# EAGLE design pro-micro-ora (EAGLE 7.1.0)
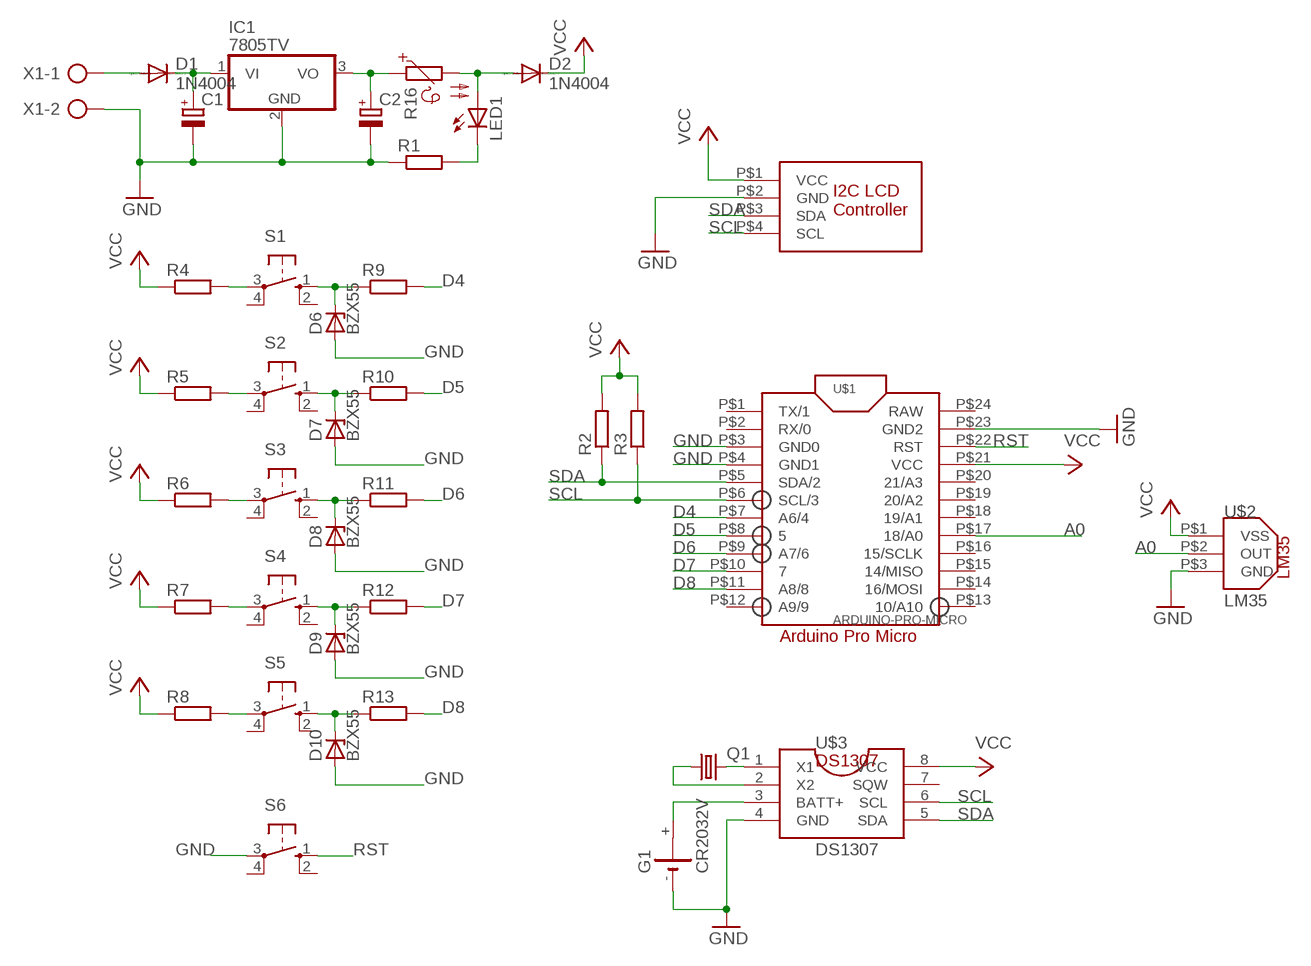
[diagram p0: schematic, sheet 1]

## Parts
C1  CPOL-EUE2.5-5  [E2,5-5]
C2  CPOL-EUE2.5-5  [E2,5-5]
D1  1N4004  [DO41-10]
D2  1N4004  [DO41-10]
D6  BZX55  [DO35Z10]
D7  BZX55  [DO35Z10]
D8  BZX55  [DO35Z10]
D9  BZX55  [DO35Z10]
D10  BZX55  [DO35Z10]
G1  CR2032V  [CR2032V]
IC1  7805TV  [TO220V]
LED1  LED5MM  [LED5MM]
Q1  CRYSTALTC26H  [TC26H]
R1  R-EU_0204/7  [0204/7]
R2  R-EU_0204/7  [0204/7]
R3  R-EU_0204/7  [0204/7]
R4  R-EU_0204/7  [0204/7]
R5  R-EU_0204/7  [0204/7]
R6  R-EU_0204/7  [0204/7]
R7  R-EU_0204/7  [0204/7]
R8  R-EU_0204/7  [0204/7]
R9  R-EU_0204/7  [0204/7]
R10  R-EU_0204/7  [0204/7]
R11  R-EU_0204/7  [0204/7]
R12  R-EU_0204/7  [0204/7]
R13  R-EU_0204/7  [0204/7]
R16  PTC660  [P660]
S1  10-XX  [B3F-10XX]
S2  10-XX  [B3F-10XX]
S3  10-XX  [B3F-10XX]
S4  10-XX  [B3F-10XX]
S5  10-XX  [B3F-10XX]
S6  10-XX  [B3F-10XX]
U$1  ARDUINO-PRO-MICRO  [ARDUINO-PRO-MICRO]
U$2  LM35  [LM35]
U$3  DS1307  [DS1307]
U$4  I2C_LCD  [I2C_LCD]
X1  AK500/2  [AK500/2]

## Nets
A0: U$1.P$17(18/A0) U$2.P$2(OUT)
D4: R9.2 U$1.P$7(A6/4)
D5: R10.2 U$1.P$8
D6: R11.2 U$1.P$9(A7/6)
D7: R12.2 U$1.P$10
D8: R13.2 U$1.P$11(A8/8)
GND: C1.- C2.- D6.A D7.A D8.A D9.A D10.A G1.- IC1.2(GND) R1.1 S6.3(P) U$1.P$3(GND0) U$1.P$4(GND1) U$1.P$23(GND2) U$2.P$3(GND) U$3.4(GND) U$4.P$2(GND) X1.2
N$1: D1.A X1.1
N$2: C1.+ D1.C IC1.1(VI)
N$3: D2.A LED1.A R16.2
N$4: LED1.K(C) R1.2
N$5: C2.+ IC1.3(VO) R16.1
N$6: R4.2 S1.3(P)
N$7: R5.2 S2.3(P)
N$8: R6.2 S3.3(P)
N$9: R7.2 S4.3(P)
N$10: R8.2 S5.3(P)
N$11: D6.C R9.1 S1.1(S)
N$12: D7.C R10.1 S2.1(S)
N$13: D8.C R11.1 S3.1(S)
N$14: D9.C R12.1 S4.1(S)
N$15: D10.C R13.1 S5.1(S)
N$16: Q1.1 U$3.2(X2)
N$17: Q1.2 U$3.1(X1)
N$18: G1.+ U$3.3(BATT+)
RST: S6.1(S) U$1.P$22(RST)
SCL: R3.1 U$1.P$6(SCL/3) U$3.6(SCL) U$4.P$4(SCL)
SDA: R2.1 U$1.P$5(SDA/2) U$3.5(SDA) U$4.P$3(SDA)
VCC: D2.C R2.2 R3.2 R4.1 R5.1 R6.1 R7.1 R8.1 U$1.P$21(VCC) U$2.P$1(VSS) U$3.8(VCC) U$4.P$1(VCC)
Unconnected: G1.+@1(+) S1.2(S1) S1.4(P1) S2.2(S1) S2.4(P1) S3.2(S1) S3.4(P1) S4.2(S1) S4.4(P1) S5.2(S1) S5.4(P1) S6.2(S1) S6.4(P1) U$1.P$1(TX/1) U$1.P$2(RX/0) U$1.P$12(A9/9) U$1.P$13(10/A10) U$1.P$14(16/MOSI) U$1.P$15(14/MISO) U$1.P$16(15/SCLK) U$1.P$18(19/A1) U$1.P$19(20/A2) U$1.P$20(21/A3) U$3.7(SQW)

## Power pins joined to a net without a drawn wire
RAW: U$1.P$24(RAW)

## Library data of the parts
C1 C2 = rcl:CPOL-EU: POLARIZED CAPACITOR, European symbol
D1 D2 = diode:1N4004: DIODE general purpose rectifier, 1 A
D6-D10 = diode:BZX55: Z DIODE
G1 = battery:CR2032V: LI BATTERY Varta
IC1 = linear:78*: Positive VOLTAGE REGULATOR Source: http://cache.national.com/ds/LM/LM78L05.pdf http://www.fairchildsemi.com/ds/LM/LM7805.pdf
LED1 = led:LED: LED OSRAM: - CHIPLED LG R971, LG N971, LY N971, LG Q971, LY Q971, LO R971, LY R971 LH N974, LH R974 LS Q976, LO Q976, LY Q976 LO Q996 - Hyper CHIPLED LW Q18S LB Q993, LB Q99A, LB R99A - SideLED LS A670, LO A670, LY A670, LG A670, LP A670 LB A673, LV A673, LT A673, LW A673 LH A674 LY A675 LS A676, LA A676, LO A676, LY A676, LW A676 LS A679, LY A679, LG A679 - Hyper Micro SIDELED® LS Y876, LA Y876, LO Y876, LY Y876 LT Y87S - SmartLED LW L88C, LW L88S LB L89C, LB L89S, LG L890 LS L89K, LO L89K, LY L89K LS L896, LA L896, LO L896, LY L896 - TOPLED LS T670, LO T670, LY T670, LG T670, LP T670 LSG T670, LSP T670, LSY T670, LOP T670, LYG T670 LG T671, LOG T671, LSG T671 LB T673, LV T673, LT T673, LW T673 LH T674 LS T676, LA T676, LO T676, LY T676, LB T676, LH T676, LSB T676, LW T676 LB T67C, LV T67C, LT T67C, LS T67K, LO T67K, LY T67K, LW E67C LS E67B, LA E67B, LO E67B, LY E67B, LB E67C, LV E67C, LT E67C LW T67C LS T679, LY T679, LG T679 LS T770, LO T770, LY T770, LG T770, LP T770 LB T773, LV T773, LT T773, LW T773 LH T774 LS E675, LA E675, LY E675, LS T675 LS T776, LA T776, LO T776, LY T776, LB T776 LHGB T686 LT T68C, LB T68C - Hyper Mini TOPLED® LB M676 - Mini TOPLED Santana® LG M470 LS M47K, LO M47K, LY M47K Source: http://www.osram.convergy.de LUXEON: - LUMILED® LXK2-PW12-R00, LXK2-PW12-S00, LXK2-PW14-U00, LXK2-PW14-V00 LXK2-PM12-R00, LXK2-PM12-S00, LXK2-PM14-U00 LXK2-PE12-Q00, LXK2-PE12-R00, LXK2-PE12-S00, LXK2-PE14-T00, LXK2-PE14-U00 LXK2-PB12-K00, LXK2-PB12-L00, LXK2-PB12-M00, LXK2-PB14-N00, LXK2-PB14-P00, LXK2-PB14-Q00 LXK2-PR12-L00, LXK2-PR12-M00, LXK2-PR14-Q00, LXK2-PR14-R00 LXK2-PD12-Q00, LXK2-PD12-R00, LXK2-PD12-S00 LXK2-PH12-R00, LXK2-PH12-S00 LXK2-PL12-P00, LXK2-PL12-Q00, LXK2-PL12-R00 Source: www.luxeon.com KINGBRIGHT: KA-3528ASYC Source: www.kingbright.com
Q1 = crystal:CRYSTAL: CRYSTAL; OC_FARNELL: unknown; OC_NEWARK: unknown
R1-R13 = rcl:R-EU_: RESISTOR, European symbol
R16 = ptc-ntc:PTC660: PHILIPS PTC; OC_FARNELL: unknown; OC_NEWARK: unknown
S1-S6 = switch-omron:10-XX: OMRON SWITCH; MPN: B3F-1000; OC_FARNELL: 176432; OC_NEWARK: 36M3542
U$1 = arduino-pro-micro:ARDUINO-PRO-MICRO
U$2 = lm35:LM35
U$3 = ds1307:DS1307
U$4 = i2c-lcd-controller:I2C_LCD
X1 = con-ptr500:AK500/2: CONNECTOR; OC_FARNELL: unknown; OC_NEWARK: unknown

## Board
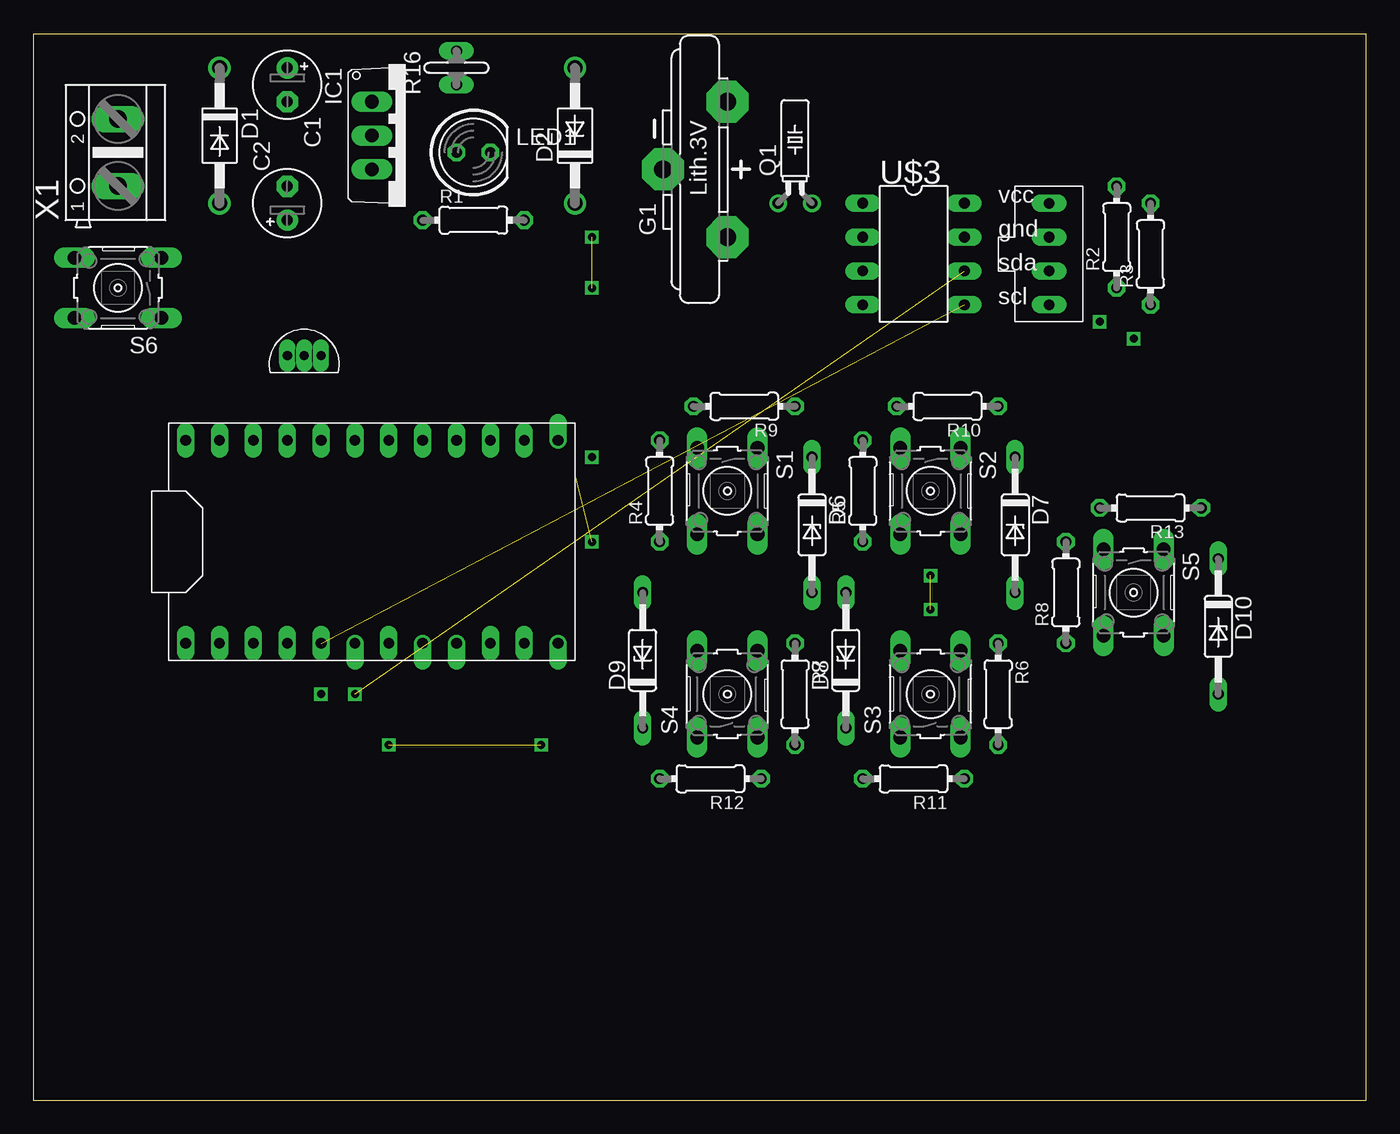
[diagram p1: board, top side]
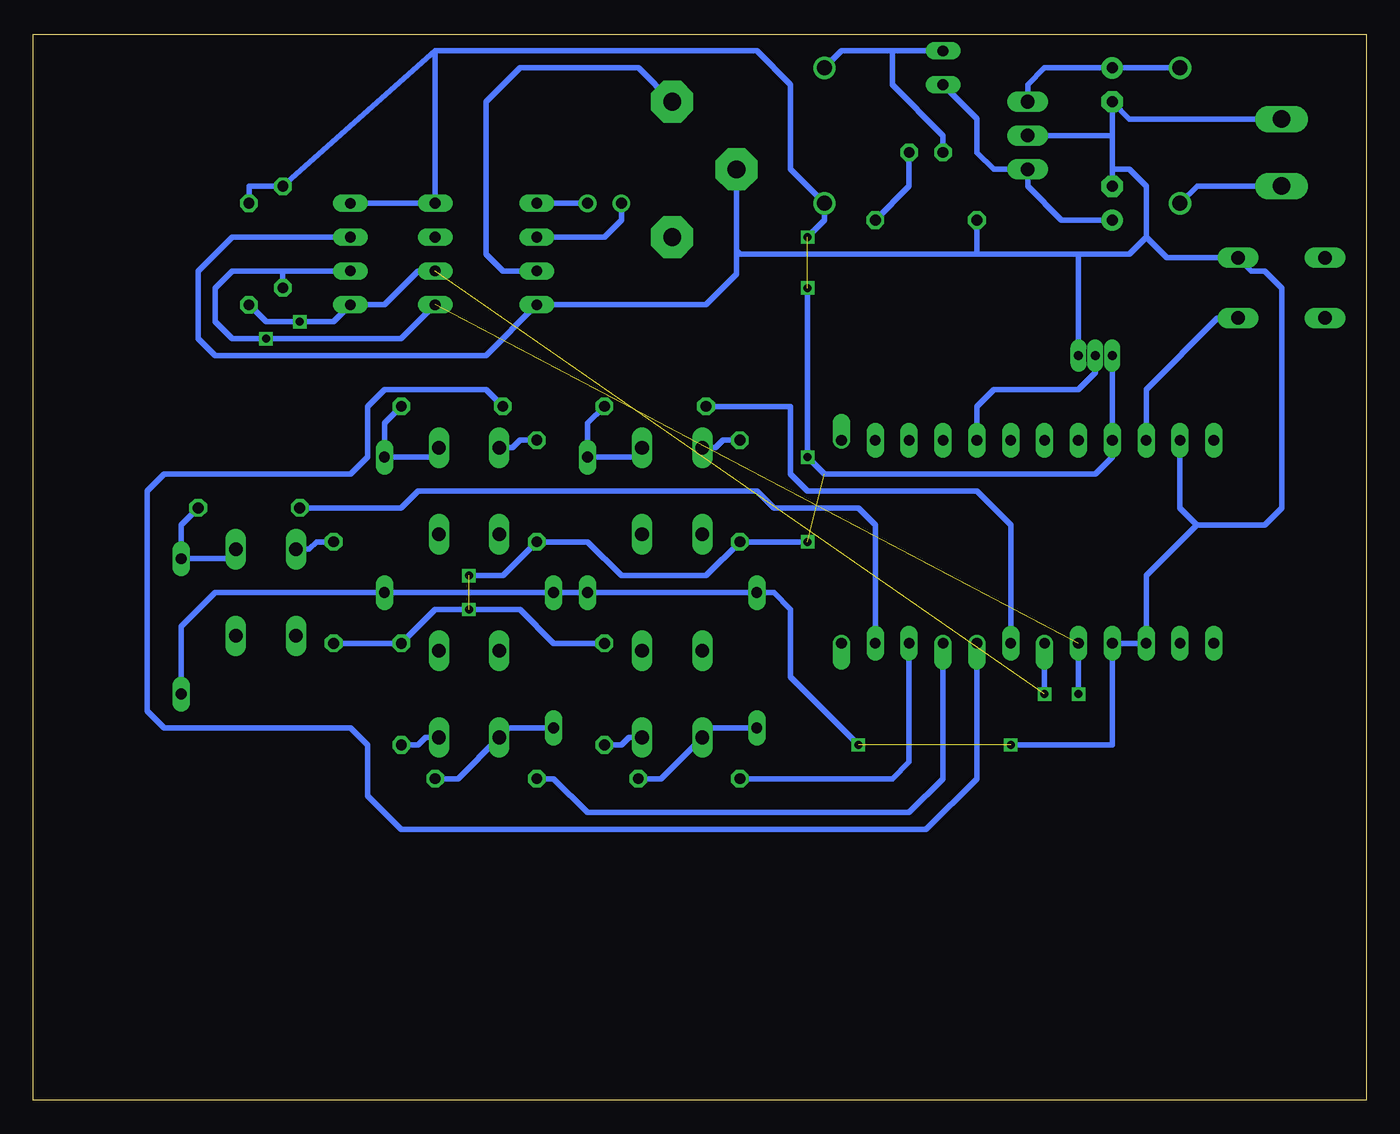
[diagram p2: board, bottom side, seen from below]

Size 100 x 80 mm. Coordinates in mm from the lower left corner, seen from the top.
Outline: 0,0 100,0 100,80 0,80 0,0
Copper layers (1*16): Top 0.035mm / dielectric 1.5mm / Bottom 0.035mm
Design rules "default": minimum track width 10mil, minimum drill 24mil, track to track 8mil, track to pad 8mil, pad to pad 8mil, via to via 8mil, smd to smd 8mil, copper to edge 40mil, drill to drill 8mil, minimum pad ring 10mil, minimum via ring 8mil, stop-mask expansion 4mil, vias tented up to drill 0mil, thermal gap 10mil

### Footprints (pad centres in the part's own frame; a part is rotated, then mirrored left to right if it is on the bottom)
E2,5-5 = drill 0.813 pad 1.6: + -1.27,0 | drill 0.813 pad 1.6 octagon: - 1.27,0
DO41-10 = drill 1.118: A 5.08,0; C -5.08,0
DO35Z10 = drill 0.813 long: A 5.08,0; C -5.08,0
CR2032V = drill 1.321 pad 3.15 octagon: + -2.54,-5.08; +@1 -2.54,5.08; - 2.286,0
TO220V = drill 1.016 long: 1 -2.54,-2.54; 2 0,-2.54; 3 2.54,-2.54
LED5MM = drill 0.813 octagon: A -1.27,0; K 1.27,0
TC26H = drill 0.813: 1 -1.27,0; 2 1.27,0
0204/7 = drill 0.813 octagon: 1 -3.81,0; 2 3.81,0
P660 = drill 0.813 long: 1 -1.27,0; 2 1.27,0
B3F-10XX = drill 1.016 long: 1 -3.251,2.261; 2 3.251,2.261; 3 -3.251,-2.261; 4 3.251,-2.261
ARDUINO-PRO-MICRO = drill 0.8 long: P$1 -7.62,15.24; P$2 -7.62,12.7; P$3 -7.62,10.16; P$4 -7.62,7.62; P$5 -7.62,5.08; P$7 -7.62,0; P$10 -7.62,-7.62; P$11 -7.62,-10.16; P$14 7.62,-10.16; P$15 7.62,-7.62; P$16 7.62,-5.08; P$17 7.62,-2.54; P$18 7.62,0; P$19 7.62,2.54; P$20 7.62,5.08; P$21 7.62,7.62; P$22 7.62,10.16; P$23 7.62,12.7; P$24 7.62,15.24 | drill 0.8 offset: P$6 -7.62,2.54; P$8 -7.62,-2.54; P$9 -7.62,-5.08; P$12 -7.62,-12.7; P$13 7.62,-12.7
LM35 = drill 0.7 pad 1.016 long: P$1 -1.27,0; P$2 0,0; P$3 1.27,0
DS1307 = drill 0.813 long: 1 -3.81,-3.81; 2 -1.27,-3.81; 3 1.27,-3.81; 4 3.81,-3.81; 5 3.81,3.81; 6 1.27,3.81; 7 -1.27,3.81; 8 -3.81,3.81
I2C_LCD = drill 0.8 long: P$1 0,3.81; P$2 0,1.27; P$3 0,-1.27; P$4 0,-3.81
AK500/2 = drill 1.321 long: 1 -2.515,0; 2 2.515,0

### Placement (x,y rotation side)
C1  19.05,76.2 270 top
C2  19.05,67.31 90 top
D1  13.97,72.39 270 top
D2  40.64,72.39 90 top
D6  58.42,43.18 270 top
D7  73.66,43.18 270 top
D8  60.96,33.02 90 top
D9  45.72,33.02 90 top
D10  88.9,35.56 270 top
G1  49.53,69.85 180 top
IC1  27.94,72.39 270 top
LED1  33.02,71.12 0 top
Q1  57.15,67.31 0 top
R1  33.02,66.04 0 top
R2  81.28,64.77 90 top
R3  83.82,63.5 90 top
R4  46.99,45.72 90 top
R5  62.23,45.72 90 top
R6  72.39,30.48 270 top
R7  57.15,30.48 270 top
R8  77.47,38.1 90 top
R9  53.34,52.07 180 top
R10  68.58,52.07 180 top
R11  66.04,24.13 180 top
R12  50.8,24.13 180 top
R13  83.82,44.45 180 top
R16  31.75,77.47 90 top
S1  52.07,45.72 270 top
S2  67.31,45.72 270 top
S3  67.31,30.48 90 top
S4  52.07,30.48 90 top
S5  82.55,38.1 270 top
S6  6.35,60.96 180 top
U$1  26.67,41.91 90 top
U$2  20.32,55.88 0 top
U$3  66.04,63.5 270 top
U$4  76.2,63.5 0 top
X1  6.35,71.12 90 top

### Tracks (layer width: path | path; a pad name or v marks a point on that pad's centre or on a via)
A0
  Bottom 0.406: U$2.P$2 20.32,54.61 21.59,53.34 27.94,53.34 29.21,52.07 U$1.P$17
D4
  Bottom 0.406: R9.2 43.18,52.07 43.18,46.99 41.91,45.72 29.21,45.72 26.67,43.18 U$1.P$7
D5
  Bottom 0.406: U$1.P$8 29.21,24.13 33.02,20.32 72.39,20.32 74.93,22.86 74.93,26.67 76.2,27.94 90.17,27.94 91.44,29.21 91.44,45.72 90.17,46.99 76.2,46.99 74.93,48.26 74.93,52.07 73.66,53.34 66.04,53.34 R10.2
D6
  Bottom 0.406: U$1.P$9 31.75,24.13 34.29,21.59 58.42,21.59 60.96,24.13 R11.2
D7
  Bottom 0.406: R12.2 35.56,24.13 34.29,25.4 U$1.P$10
D8
  Bottom 0.406: R13.2 72.39,44.45 71.12,45.72 45.72,45.72 44.45,44.45 38.1,44.45 36.83,43.18 U$1.P$11
GND  (1 unrouted)
  Bottom 0.406: X1.2 17.75,73.64 C1.- 19.05,72.39 | 19.05,72.39 19.05,69.85 | 19.05,69.85 C2.- | IC1.2 19.05,72.39 | 16.51,64.77 17.78,63.5 21.59,63.5 | 16.51,64.77 16.51,68.58 17.78,69.85 19.05,69.85 | 78.74,64.77 U$4.P$2 85.09,64.77 87.63,62.23 87.63,57.15 86.36,55.88 66.04,55.88 U$3.4 49.53,59.69 47.24,61.98 G1.- 47.24,63.75 46.99,63.5 29.21,63.5 | 29.21,63.5 21.59,63.5 | R1.1 29.21,63.5 | 16.51,64.77 14.96,63.22 S6.3 8.61,62.23 7.62,62.23 6.35,60.96 6.35,44.45 7.62,43.18 12.7,43.18 | 12.7,43.18 16.51,39.37 U$1.P$3 U$1.P$4 19.05,26.67 26.67,26.67 | U$1.P$23 13.97,44.45 12.7,43.18 | D10.A 88.9,35.56 86.36,38.1 D7.A D8.A D6.A D9.A 44.45,38.1 43.18,36.83 43.18,31.75 38.1,26.67 | U$2.P$3 21.59,63.5
N$1
  Bottom 0.406: X1.1 12.68,68.61 D1.A
N$2
  Bottom 0.406: D1.C C1.+ 24.13,77.47 25.4,76.2 IC1.1
N$3
  Bottom 0.406: R16.2 35.56,78.74 | 35.56,78.74 39.37,78.74 D2.A | LED1.A 31.75,72.39 35.56,76.2 35.56,78.74
N$4
  Bottom 0.406: LED1.K 34.29,68.58 R1.2
N$5
  Bottom 0.406: C2.+ 22.86,66.04 25.4,68.58 IC1.3 27.94,69.85 29.21,71.12 29.21,73.66 R16.1
N$6
  Bottom 0.406: S1.3 48.82,48.97 48.26,49.53 R4.2
N$7
  Bottom 0.406: S2.3 64.06,48.97 63.5,49.53 R5.2
N$8
  Bottom 0.406: S3.3 70.56,27.23 71.12,26.67 R6.2
N$9
  Bottom 0.406: S4.3 55.32,27.23 55.88,26.67 R7.2
N$10
  Bottom 0.406: S5.3 79.3,41.35 78.74,41.91 R8.2
N$11
  Bottom 0.406: 53.9,48.97 S1.1 54.61,48.69 54.61,48.26 D6.C 58.42,50.8 R9.1
N$12
  Bottom 0.406: 69.14,48.97 S2.1 69.85,48.69 69.85,48.26 D7.C 73.66,50.8 R10.1
N$13
  Bottom 0.406: D8.C 64.34,27.94 S3.1 68.15,24.13 R11.1
N$14
  Bottom 0.406: R12.1 52.91,24.13 S4.1 49.53,27.51 49.53,27.94 D9.C
N$15
  Bottom 0.406: S5.1 85.09,41.07 85.09,40.64 D10.C 88.9,43.18 R13.1
N$16
  Bottom 0.406: U$3.2 57.15,64.77 55.88,66.04 Q1.1
N$17
  Bottom 0.406: U$3.1 Q1.2
N$18
  Bottom 0.406: U$3.3 64.77,62.23 66.04,63.5 66.04,74.93 63.5,77.47 54.61,77.47 G1.+
N$19  (via drill 0.6)
  other vias: 67.31,39.37
N$20  (via drill 0.6)
  other vias: 21.59,30.48
N$21  (via drill 0.6)
  other vias: 41.91,41.91
N$22  (via drill 0.6)
  other vias: 41.91,60.96
N$23  (via drill 0.6)
  other vias: 41.91,64.77
N$24  (via drill 0.6)
  other vias: 26.67,26.67
N$25  (via drill 0.6)
  other vias: 38.1,26.67
N$26  (via drill 0.6)
  other vias: 24.13,30.48
RST
  Bottom 0.406: S6.1 11.15,58.7 16.51,53.34 U$1.P$22
SCL  (via drill 0.6)  (1 unrouted)
  Bottom 0.406: U$3.6 71.12,62.23 73.66,59.69 U$4.P$4 77.47,58.42 v80.01,58.42 82.55,58.42 R3.1 | U$1.P$6 24.13,30.48
SDA  (via drill 0.6)  (1 unrouted)
  Bottom 0.406: U$4.P$3 81.28,62.23 | 81.28,62.23 R2.1 | U$3.5 72.39,57.15 v82.55,57.15 85.09,57.15 86.36,58.42 86.36,60.96 85.09,62.23 81.28,62.23 | U$1.P$5 21.59,30.48
VCC  (via drill 0.6)  (3 unrouted)
  Bottom 0.406: U$4.P$1 U$3.8 69.85,78.74 | 69.85,78.74 45.72,78.74 43.18,76.2 43.18,69.85 D2.C 40.64,66.04 41.91,64.77 | 69.85,78.74 R2.2 83.82,68.58 R3.2 | R8.1 R6.1 69.85,36.83 v67.31,36.83 63.5,36.83 60.96,34.29 R7.1 | 67.31,39.37 64.77,39.37 R5.1 58.42,41.91 55.88,39.37 49.53,39.37 R4.1 41.91,41.91 | U$2.P$1 U$1.P$21 19.05,48.26 20.32,46.99 40.64,46.99 v41.91,48.26 41.91,60.96